# EAGLE schematic flipflop-sr (EAGLE 6.4)
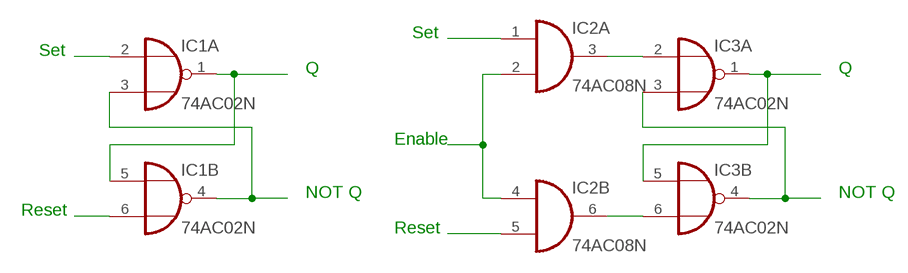
[diagram p0: schematic, sheet 1]

## Parts
IC1  74AC02N  [DIL14]
IC2  74AC08N  [DIL14]
IC3  74AC02N  [DIL14]

## Nets
N$1: IC1.3(A:I1) IC1.4(B:O)
N$2: IC1.1(A:O) IC1.5(B:I0)
N$3: IC1.6(B:I1)
N$4: IC1.2(A:I0)
N$5: IC3.3(A:I1) IC3.4(B:O)
N$6: IC2.6(B:O) IC3.6(B:I1)
N$7: IC2.3(A:O) IC3.2(A:I0)
N$8: IC3.1(A:O) IC3.5(B:I0)
N$9: IC2.2(A:I1) IC2.4(B:I0)
N$10: IC2.1(A:I0)
N$11: IC2.5(B:I1)
Unconnected: IC1.8(C:I0) IC1.9(C:I1) IC1.10(C:O) IC1.11(D:I0) IC1.12(D:I1) IC1.13(D:O) IC2.8(C:O) IC2.9(C:I0) IC2.10(C:I1) IC2.11(D:O) IC2.12(D:I0) IC2.13(D:I1) IC3.8(C:I0) IC3.9(C:I1) IC3.10(C:O) IC3.11(D:I0) IC3.12(D:I1) IC3.13(D:O)

## Notes on the sheet
- Set
- Set
- Q | Q
- Enable
- NOT Q | NOT Q
- Reset
- Reset

## Power pins joined to a net without a drawn wire
GND: IC1.7(P:GND) IC2.7(P:GND) IC3.7(P:GND)
VCC: IC1.14(P:VCC) IC2.14(P:VCC) IC3.14(P:VCC)

## Library data of the parts
IC1 IC3 = 74xx-eu:74*02: Quad 2-input NOR gate
IC2 = 74xx-eu:74*08: Quad 2-input AND gate